# Altium schematic sheet тест.SchDoc
size A4
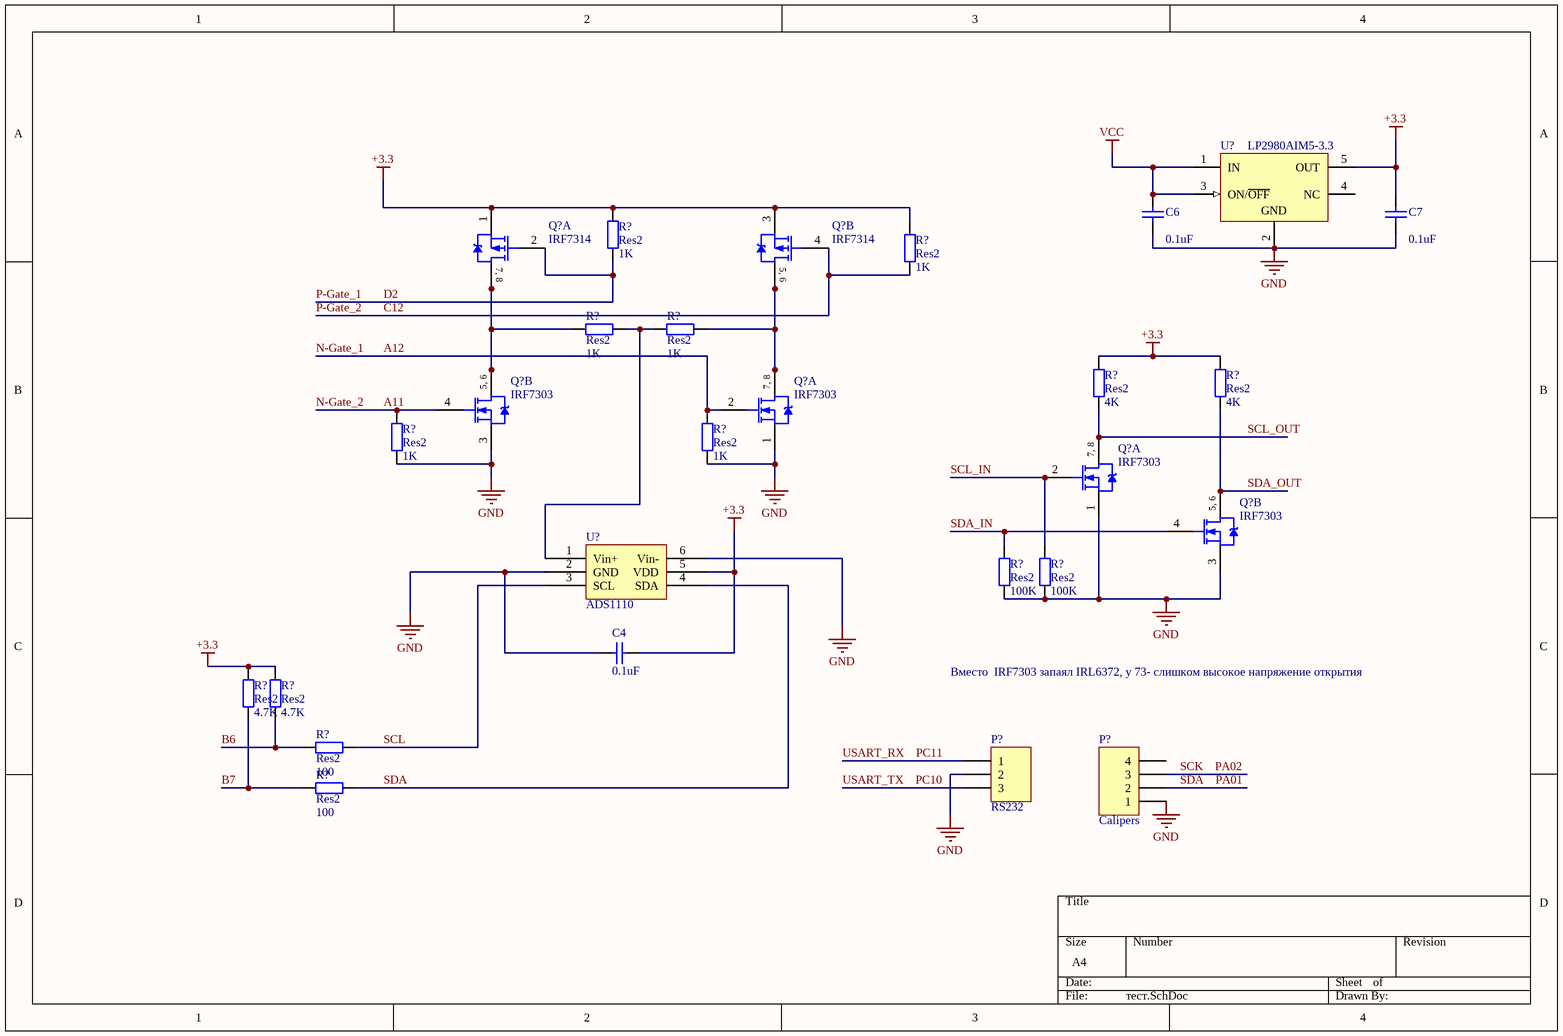
[diagram p0: тест.SchDoc]

## Parts
(Parts that share a designator on the sheet are numbered #1, #2 ... from top to bottom, then left to right.)
C4  value 0.1uF  [1608[0603]]  (hidden comment: Cap Semi)
C6  value 0.1uF  [1608[0603]]  (hidden comment: Cap Semi)
C7  value 0.1uF  [1608[0603]]  (hidden comment: Cap Semi)
P?#1  RS232  [HDR1X3]
P?#2  Calipers  [HDR1X4]
Q?#1  IRF7314  [SO-8_N]  (part A of 2)
Q?#2  IRF7314  [SO-8_N]  (part B of 2)
Q?#3  IRF7303  [SO-8_N]  (part B of 2)
Q?#4  IRF7303  [SO-8_N]  (part A of 2)
Q?#5  IRF7303  [SO-8_N]  (part A of 2)
Q?#6  IRF7303  [SO-8_N]  (part B of 2)
R?#1  Res2  value 1K  [AXIAL-0.4]
R?#2  Res2  value 1K  [AXIAL-0.4]
R?#3  Res2  value 1K  [AXIAL-0.4]
R?#4  Res2  value 1K  [AXIAL-0.4]
R?#5  Res2  value 4K  [AXIAL-0.4]
R?#6  Res2  value 4K  [AXIAL-0.4]
R?#7  Res2  value 1K  [AXIAL-0.4]
R?#8  Res2  value 1K  [AXIAL-0.4]
R?#9  Res2  value 100K  [AXIAL-0.4]
R?#10  Res2  value 100K  [AXIAL-0.4]
R?#11  Res2  value 4.7K  [AXIAL-0.4]
R?#12  Res2  value 4.7K  [AXIAL-0.4]
R?#13  Res2  value 100  [AXIAL-0.4]
R?#14  Res2  value 100  [AXIAL-0.4]
U?#1  LP2980AIM5-3.3  [MF05A_N]
U?#2  ADS1110  [SOT-23_A]

## Nets
+3.3: C4.1 C7.2 Q?#1.1(S) Q?#2.3(S) R?#1.2 R?#2.2 R?#5.2 R?#6.2 R?#11.2 R?#12.2 U?#1.5(OUT) U?#2.5(VDD)
GND: C4.2 C6.1 C7.1 P?#1.2 P?#2.1 Q?#3.3(S) Q?#4.1(S) Q?#5.1(S) Q?#6.3(S) R?#7.1 R?#8.1 R?#9.1 R?#10.1 U?#1.2(GND) U?#2.2(GND) U?#2.6(Vin-)
VCC: C6.2 U?#1.1(IN) U?#1.3(ON/~{OFF})
A11: Q?#3.4(G) R?#7.2  [also labelled N-Gate_2]
A12: Q?#4.2(G) R?#8.2  [also labelled N-Gate_1]
B6: R?#12.1 R?#13.2
B7: R?#11.1 R?#14.2
C12: Q?#2.4(G) R?#2.1  [also labelled P-Gate_2]
D2: Q?#1.2(G) R?#1.1  [also labelled P-Gate_1]
SCK    PA02: P?#2.3
SCL: R?#13.1 U?#2.3(SCL)
SCL_IN: Q?#5.2(G) R?#10.2
SCL_OUT: Q?#5.7(D) Q?#5.8(D) R?#5.1
SDA: R?#14.1 U?#2.4(SDA)
SDA    PA01: P?#2.2
SDA_IN: Q?#6.4(G) R?#9.2
SDA_OUT: Q?#6.5(D) Q?#6.6(D) R?#6.1
USART_RX    PC11: P?#1.1
USART_TX    PC10: P?#1.3
NetQ?#1_7: Q?#1.7(D) Q?#1.8(D) Q?#3.5(D) Q?#3.6(D) R?#3.1
NetQ?#2_5: Q?#2.5(D) Q?#2.6(D) Q?#4.7(D) Q?#4.8(D) R?#4.2
NetR?#3_2: R?#3.2 R?#4.1 U?#2.1(Vin+)

Not connected (* = marked no-connect by the designer): P?#2 4; U?#1 4(NC)

## Notes on the sheet
- Вместо  IRF7303 запаял IRL6372, у 73- слишком высокое напряжение открытия
- (in symbol IRF7303, part A) 7, 8
- (in symbol IRF7303, part B) 5, 6
- (in symbol IRF7314, part A) 7, 8
- (in symbol IRF7314, part B) 5, 6

## Library data of the parts
C4 C6 C7 = Cap Semi: Capacitor (Semiconductor SIM Model); Published: 8-Jun-2000; LatestRevisionDate: 29-May-2009; LatestRevisionNote: IPC-7351 Footprint Added.; PackageReference: C1206; Publisher: Altium Limited; PackageDescription: Chip Capacitor
P?#1 = Header 3: Header, 3-Pin; LatestRevisionDate: 17-Jul-2002; LatestRevisionNote: Re-released for DXP Platform.; Publisher: Altium Limited
P?#2 = Header 4: Header, 4-Pin; LatestRevisionDate: 17-Jul-2002; LatestRevisionNote: Re-released for DXP Platform.; Publisher: Altium Limited
Q?#1 Q?#2 = IRF7314: HEXFET Power MOSFET; Published: 8-Jun-2000; LatestRevisionDate: 13-Apr-2006; LatestRevisionNote: IPC-7351 Footprint Added.; DatasheetVersion: Nov-1997; PackageVersion: Feb-2001; PackageReference: SO-8; Publisher: Altium Limited; PackageDescription: 8-Pin Plastic Small Outline Integrated Circuit 1.27 mm Pitch; Code_JEDEC: MS-012-AA; Code_IPC: SOIC127P600-8; ComponentLink1Description: Manufacturer Link; ComponentLink1URL: http://www.irf.com/; ComponentLink2Description: Datasheet; ComponentLink2URL: http://www.irf.com/product-info/datasheets/data/irf7314.pdf
Q?#3-Q?#6 = IRF7303: HEXFET Power MOSFET; Published: 8-Jun-2000; LatestRevisionDate: 13-Apr-2006; LatestRevisionNote: IPC-7351 Footprint Added.; DatasheetVersion: Aug-1997; PackageVersion: Feb-2001; PackageReference: SO-8; Publisher: Altium Limited; PackageDescription: 8-Pin Plastic Small Outline Integrated Circuit 1.27 mm Pitch; Code_JEDEC: MS-012-AA; Code_IPC: SOIC127P600-8; ComponentLink1Description: Manufacturer Link; ComponentLink1URL: http://www.irf.com/; ComponentLink2Description: Datasheet; ComponentLink2URL: http://www.irf.com/product-info/datasheets/data/irf7303.pdf
R?#1-R?#14 = Res2: Resistor; Published: 8-Jun-2000; LatestRevisionDate: 17-Jul-2002; LatestRevisionNote: Re-released for DXP Platform.; PackageReference: AXIAL-0.4; Publisher: Altium Limited; PackageDescription: Axial Device, Thru-Hole; 2 Leads; 0.4 in Pin Spacing
U?#1 = LP2980AIM5-3.3: Micropower 50 mA Ultra Low-Dropout Regulator, 5-pin SOT-23; Manufacturer: National Semiconductor; PackageTopMarking: L00A*XTT; PowerWise: N; CompType: LDO IC; Published: 4-Dec-2008; DatasheetVersion: Sep-2006; PackageVersion: revD, Aug-2008; PackageReference: MF05A; Publisher: Altium Limited; PackageDescription: Molded SOT-23, .115 x .063 x .040 in Body, 5 Lead, .0375 in Pitch; Supplier 1: Farnell; Supplier Part Number 1: 1212201; PartNumber: LP2980AIM5-3.3; RoHS: N; PinCount: 5; ComponentLink1Description: LP2980 Datasheet; ComponentLink1URL: http://www.national.com/ds/LP/LP2980.pdf; ComponentLink2Description: LP2980 Web Page; ComponentLink2URL: http://www.national.com/pf/LP/LP2980.html; ComponentLink3Description: MF05A Package Page; ComponentLink3URL: http://www.national.com/packaging/folders/mf05a.html
U?#2 = ADS1110: 16-Bit ANALOG-TO-DIGITAL CONVERTER